# EasyEDA Pro project bandoneo.eprj

# Schematic LeftWing
Board Name: Board1; Create Date: 2025-07-18; Page Name: P1; Project Name: bandoneo; Schematic Name: LeftWing; Update Date: 2025-07-19; Company: EasyEDA.com; Page Size: A4; Version: V1.0
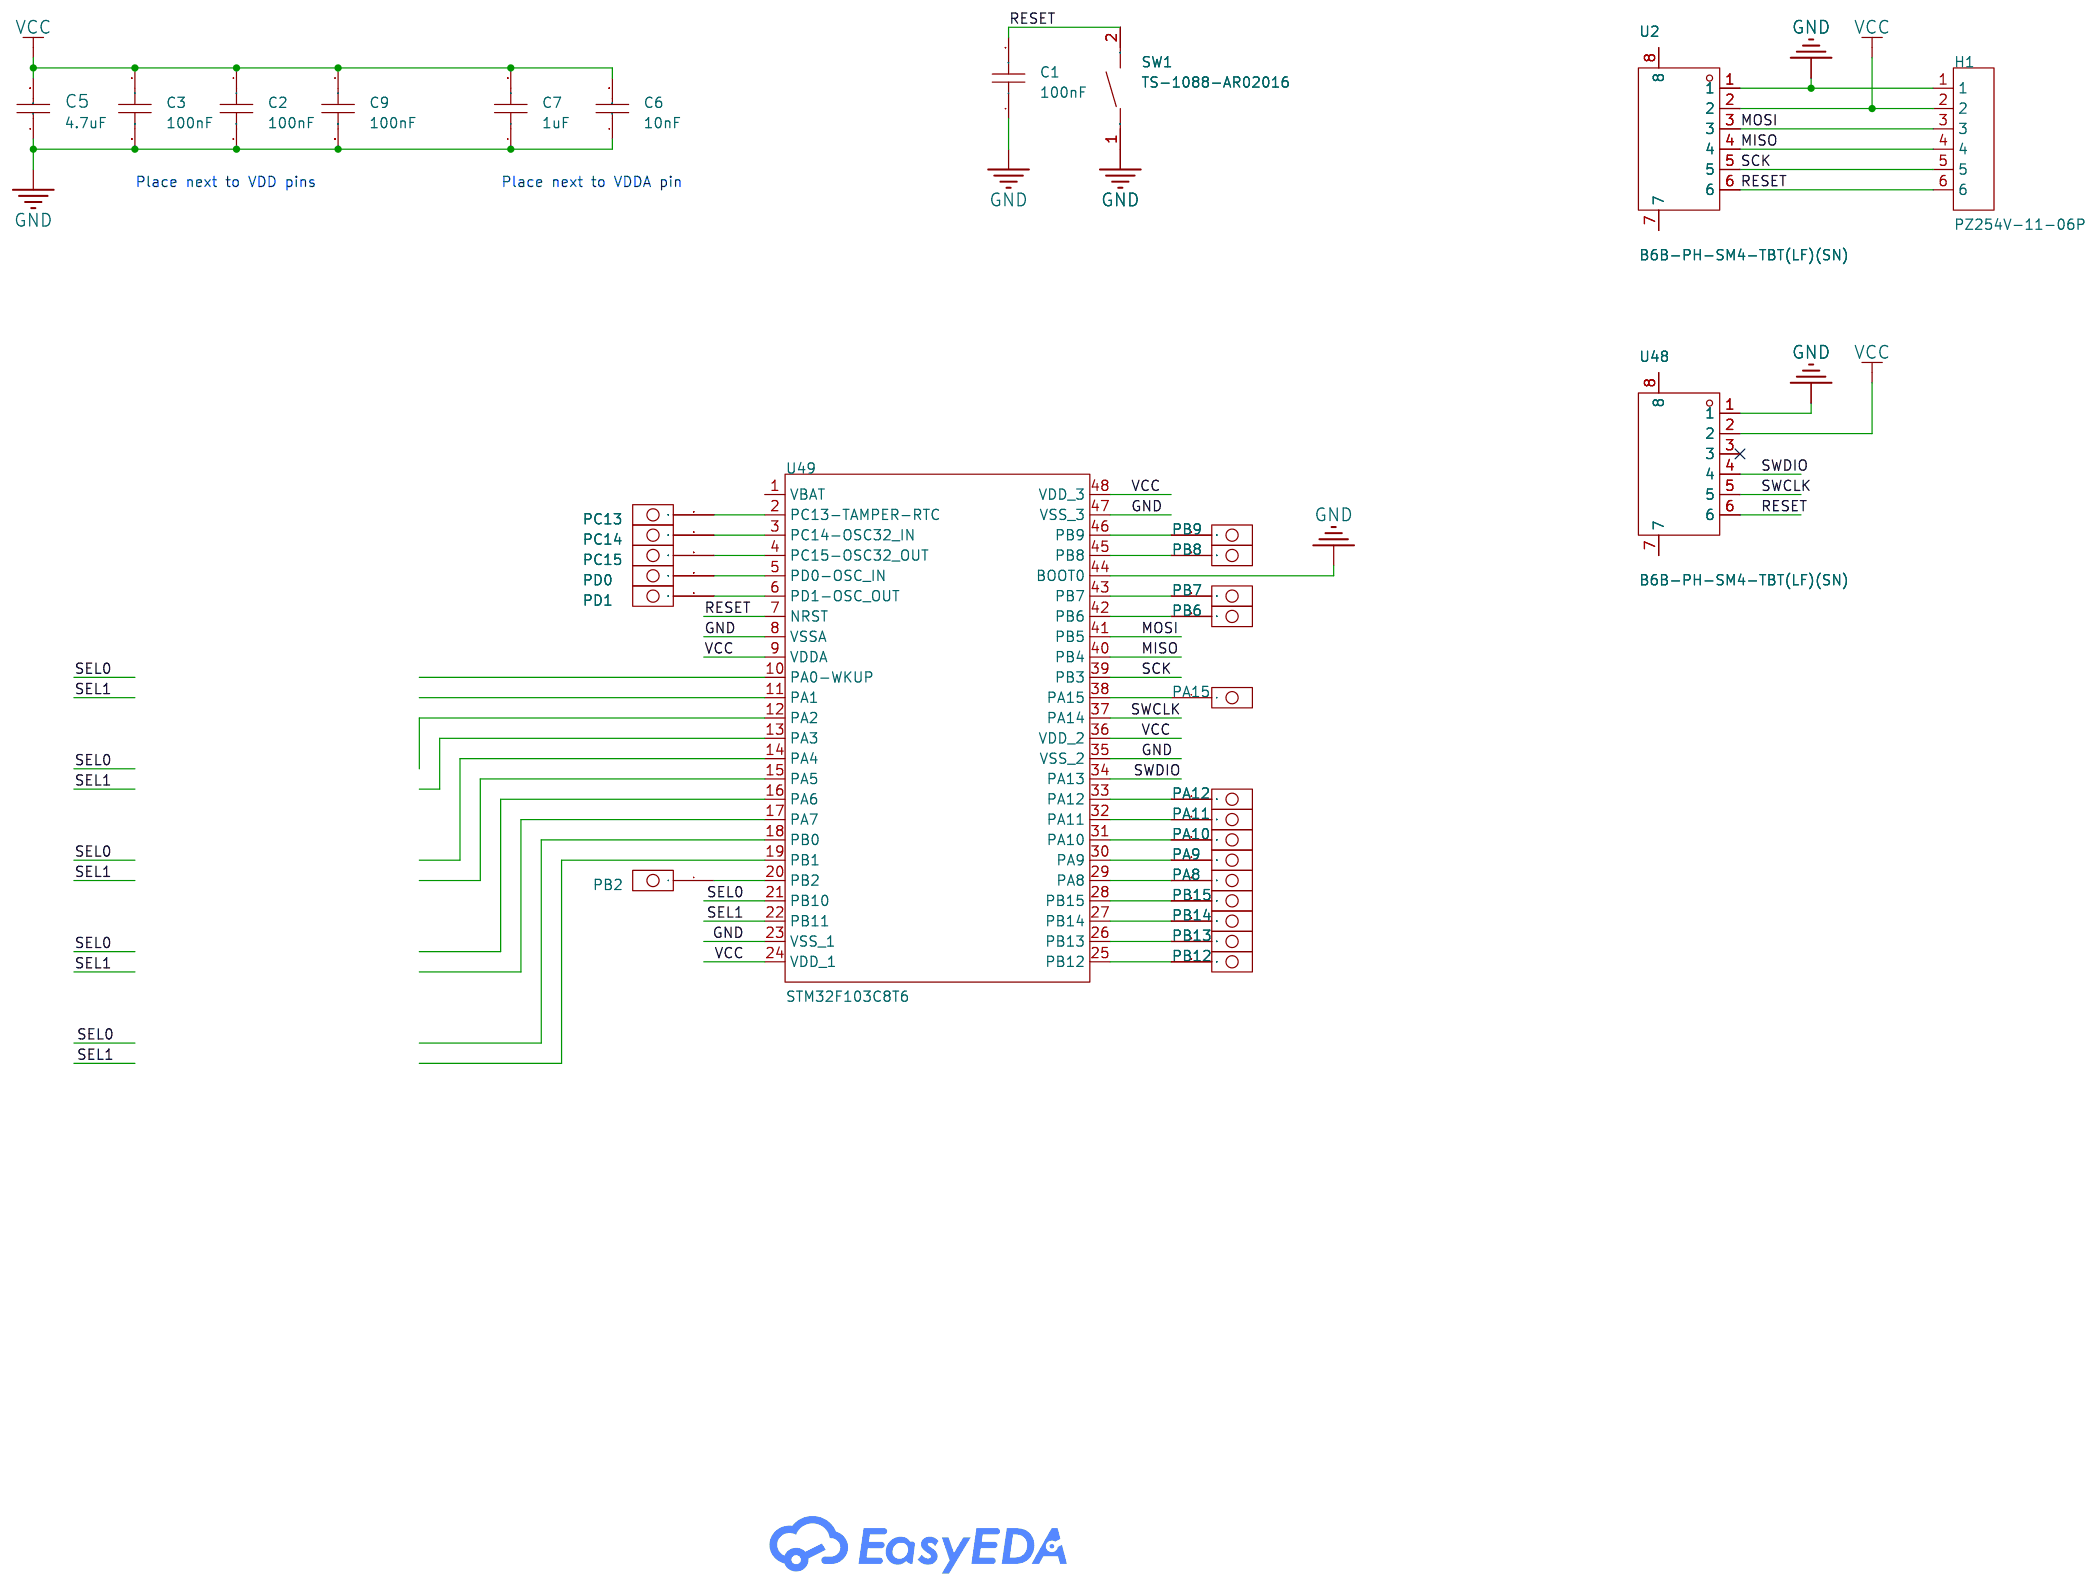
[diagram p0: schematic sheet]

## Parts
C1  100nF  [C0402]
C2  100nF  [C0402]
C3  100nF  [C0402]
C5  4.7uF  [C0402]
C6  10nF  [C0402]
C7  1uF  [C0402]
C9  100nF  [C0402]
CBB1  -
CBB2  -
CBB3  -
CBB4  -
CBB5  -
H1  PZ254V-11-06P  [HDR-TH_6P-P2.54-V-M]  (no BOM)
PA8  -  [PinHole]
PA9  -  [PinHole]
PA10  -  [PinHole]
PA11  -  [PinHole]
PA12  -  [PinHole]
PA15  -  [PinHole]
PB2  -  [PinHole]
PB6  -  [PinHole]
PB7  -  [PinHole]
PB8  -  [PinHole]
PB9  -  [PinHole]
PB12  -  [PinHole]
PB13  -  [PinHole]
PB14  -  [PinHole]
PB15  -  [PinHole]
PC13  -  [PinHole]
PC14  -  [PinHole]
PC15  -  [PinHole]
PD0  -  [PinHole]
PD1  -  [PinHole]
SW1  TS-1088-AR02016  [SW-SMD_L3.9-W3.0-P4.45]
U2  B6B-PH-SM4-TBT(LF)(SN)  [CONN-SMD_B6B-PH-SM4-TBT-LF-SN]
U48  B6B-PH-SM4-TBT(LF)(SN)  [CONN-SMD_B6B-PH-SM4-TBT-LF-SN]
U49  STM32F103C8T6  [LQFP-48_L7.0-W7.0-P0.50-LS9.0-BL]

## Library data of the parts
C1-C3 C9 = CL05B104KO5NNNC: LCSC Part Name: 100nF ±10% 16V; Supplier Part: C1525; Manufacturer: SAMSUNG(三星); Supplier Footprint: 0402; JLCPCB Part Class: Basic Part; Datasheet: https://atta.szlcsc.com/upload/public/pdf/source/20160218/1457707763339.pdf; Supplier: LCSC; Tolerance: ±10%
C5 = CL05A475MP5NRNC: LCSC Part Name: 4.7uF ±20% 10V; Supplier Part: C23733; Manufacturer: SAMSUNG(三星); Supplier Footprint: 0402; JLCPCB Part Class: Basic Part; Datasheet: https://atta.szlcsc.com/upload/public/pdf/source/20160218/1457707763339.pdf; Supplier: LCSC; Tolerance: ±20%
C6 = CL05B103KB5NNNC: LCSC Part Name: 10nF ±10% 50V; Supplier Part: C15195; Manufacturer: SAMSUNG(三星); Supplier Footprint: 0402; JLCPCB Part Class: Basic Part; Datasheet: https://atta.szlcsc.com/upload/public/pdf/source/20160218/1457707763339.pdf; Supplier: LCSC; Tolerance: ±10%
C7 = CL05A105KA5NQNC: LCSC Part Name: 1uF ±10% 25V; Supplier Part: C52923; Manufacturer: SAMSUNG(三星); Supplier Footprint: 0402; JLCPCB Part Class: Basic Part; Datasheet: https://atta.szlcsc.com/upload/public/pdf/source/20160218/1457707763339.pdf; Supplier: LCSC; Tolerance: ±10%
H1 = PZ254V-11-06P: LCSC Part Name: 1x6P 间距:2.54mm 方针 直插; Supplier Part: C492405; Manufacturer: XFCN(兴飞); Supplier Footprint: 插件,P=2.54mm; JLCPCB Part Class: Extended Part; Datasheet: https://atta.szlcsc.com/upload/public/pdf/source/20200309/C492405_597F1930F5B55CC3C7FD95458F1C3977.pdf; Supplier: LCSC; Pin Structure: 1x6P; Pitch: 2.54mm; Circluar Pins/Square Pins: Policy; Mounting Type: Straight; Number of Rows: Single Row; Number of Pins: 6P; Length of Mating Pin: 6mm; Insulation Height: 2.5mm; Length of End Connection Pin: 3mm; Contact Material: Brass; Operating Temperature: -40℃~+105℃; Color: Black
PA8-PA12 PA15 PB2 PB6-PB9 PB12-PB15 PC13-PC15 PD0 PD1 = PinHole
SW1 = TS-1088-AR02016: LCSC Part Name: 4*3*2mm 立贴 轻触开关; Supplier Part: C720477; Manufacturer: XUNPU(讯普); Supplier Footprint: SMD; JLCPCB Part Class: Basic Part; Datasheet: https://atta.szlcsc.com/upload/public/pdf/source/20200810/C720475_60D09DD6C54279ADDB2DC25100F1CC11.pdf; Supplier: LCSC; Circuit: SPST; Actuator Style: Round Button; Operating Force: 160gf; Mounting Style: Brick nogging; Switch Length: 4mm; Switch Width: 3mm; Switch Height: 2mm; Strike Gundam: 不带; Contact Current: 50mA; Voltage Rating (DC): 12V; Insulation Resistance: 100MΩ; Actuator/Cap Color: Black; Pin Style: SMDSplicing; Mechanical Life: 10万次; Operating Temperature: -30℃~+80℃
U2 U48 = B6B-PH-SM4-TBT(LF)(SN): LCSC Part Name: 1x6P 间距:2mm 立贴 系列:PH; Supplier Part: C265088; Manufacturer: JST; Supplier Footprint: SMD,P=2mm; JLCPCB Part Class: Extended Part; Datasheet: https://atta.szlcsc.com/upload/public/pdf/source/20181010/C265101_22107ACC4D8714694FDA2DD97145FA81.pdf; Supplier: LCSC; Pins Structure: 1x6P; Pitch: 2mm; Mounting Style: Brick nogging; Reference Series: PH; Number of Pins: 6P; Number of Rows: 1; Number of PINs Per Row: 6; Current Rating (Max): 2A; Contact Material: Copper Alloy; Contact Plating: Tin; Operating Temperature Range: -25℃~+85℃; Rated Voltage (Max): 100V; Plastic Material: PA; Flame Retardant Rating: UL94V-0; Supplementary Features: 辅助焊脚; Colour: 米色; Z-Height of the Board: 6.6mm; X-Length of Bottom Edge on Board (Spacing Line): 15.95mm; Y-Width of Bottom Edge on Board: 7mm
U49 = STM32F103C8T6: LCSC Part Name: 主流增强型ARM Cortex-M3 MCU，具有64 KB Flash、72 MHz CPU、电机控制、USB和CAN; Supplier Part: C8734; Manufacturer: ST(意法半导体); Supplier Footprint: LQFP-48(7x7); JLCPCB Part Class: Extended Part; Datasheet: https://atta.szlcsc.com/upload/public/pdf/source/20220812/8363ACEC51AD55ECEB84799464F7CB85.pdf; Supplier: LCSC; CPU Core: ARM-M3; CPU Maximum Speed: 72MHz; Program Storage Size: 64KB; Program Memory Type: FLASH; Number of I/O: 37; ADC (Bit): 12bit; Voltage - Supply: 2V~3.6V

## Nets
GND: C1.1 C2.2 C3.2 C5.1 C6.1 C7.1 C9.2 H1.1 SW1.1 U2.1 U48.1 U49.8(VSSA) U49.23(VSS_1) U49.35(VSS_2) U49.44(BOOT0) U49.47(VSS_3)
VCC: C2.1 C3.1 C5.2 C6.2 C7.2 C9.1 H1.2 U2.2 U48.2 U49.9(VDDA) U49.24(VDD_1) U49.36(VDD_2) U49.48(VDD_3)
MISO: H1.4 U2.4 U49.40(PB4)
MOSI: H1.3 U2.3 U49.41(PB5)
RESET: C1.2 H1.6 SW1.2 U2.6 U48.6 U49.7(NRST)
SCK: H1.5 U2.5 U49.39(PB3)
SEL0: CBB1.(SEL1) CBB2.(SEL1) CBB3.(SEL1) CBB4.(SEL1) CBB5.(SEL1) U49.10(PA0-WKUP) U49.11(PA1) U49.12(PA2) U49.13(PA3) U49.14(PA4) U49.15(PA5) U49.16(PA6) U49.17(PA7) U49.18(PB0) U49.19(PB1) U49.21(PB10) U49.22(PB11)
SWCLK: U48.5 U49.37(PA14)
SWDIO: U48.4 U49.34(PA13)
Net-(PA8-1): PA8.1 U49.29(PA8)
Net-(PA9-1): PA9.1 U49.30(PA9)
Net-(PA10-1): PA10.1 U49.31(PA10)
Net-(PA11-1): PA11.1 U49.32(PA11)
Net-(PA12-1): PA12.1 U49.33(PA12)
Net-(PA15-1): PA15.1 U49.38(PA15)
Net-(PB2-1): PB2.1 U49.20(PB2)
Net-(PB6-1): PB6.1 U49.42(PB6)
Net-(PB7-1): PB7.1 U49.43(PB7)
Net-(PB8-1): PB8.1 U49.45(PB8)
Net-(PB9-1): PB9.1 U49.46(PB9)
Net-(PB12-1): PB12.1 U49.25(PB12)
Net-(PB13-1): PB13.1 U49.26(PB13)
Net-(PB14-1): PB14.1 U49.27(PB14)
Net-(PB15-1): PB15.1 U49.28(PB15)
Net-(PC13-1): PC13.1 U49.2(PC13-TAMPER-RTC)
Net-(PC14-1): PC14.1 U49.3(PC14-OSC32_IN)
Net-(PC15-1): PC15.1 U49.4(PC15-OSC32_OUT)
Net-(PD0-1): PD0.1 U49.5(PD0-OSC_IN)
Net-(PD1-1): PD1.1 U49.6(PD1-OSC_OUT)

Not connected (* = marked no-connect by the designer): U2 7 8; U48 3* 7 8; U49 1(VBAT)

## Notes on the sheet
- Place next to VDD pins
- Place next to VDDA pin

# Schematic KeyGroup
Create Date: 2025-07-19; Page Name: P1; Project Name: bandoneo; Schematic Name: KeyGroup; Update Date: 2025-07-19; Company: EasyEDA.com; Page Size: A4; Version: V1.0
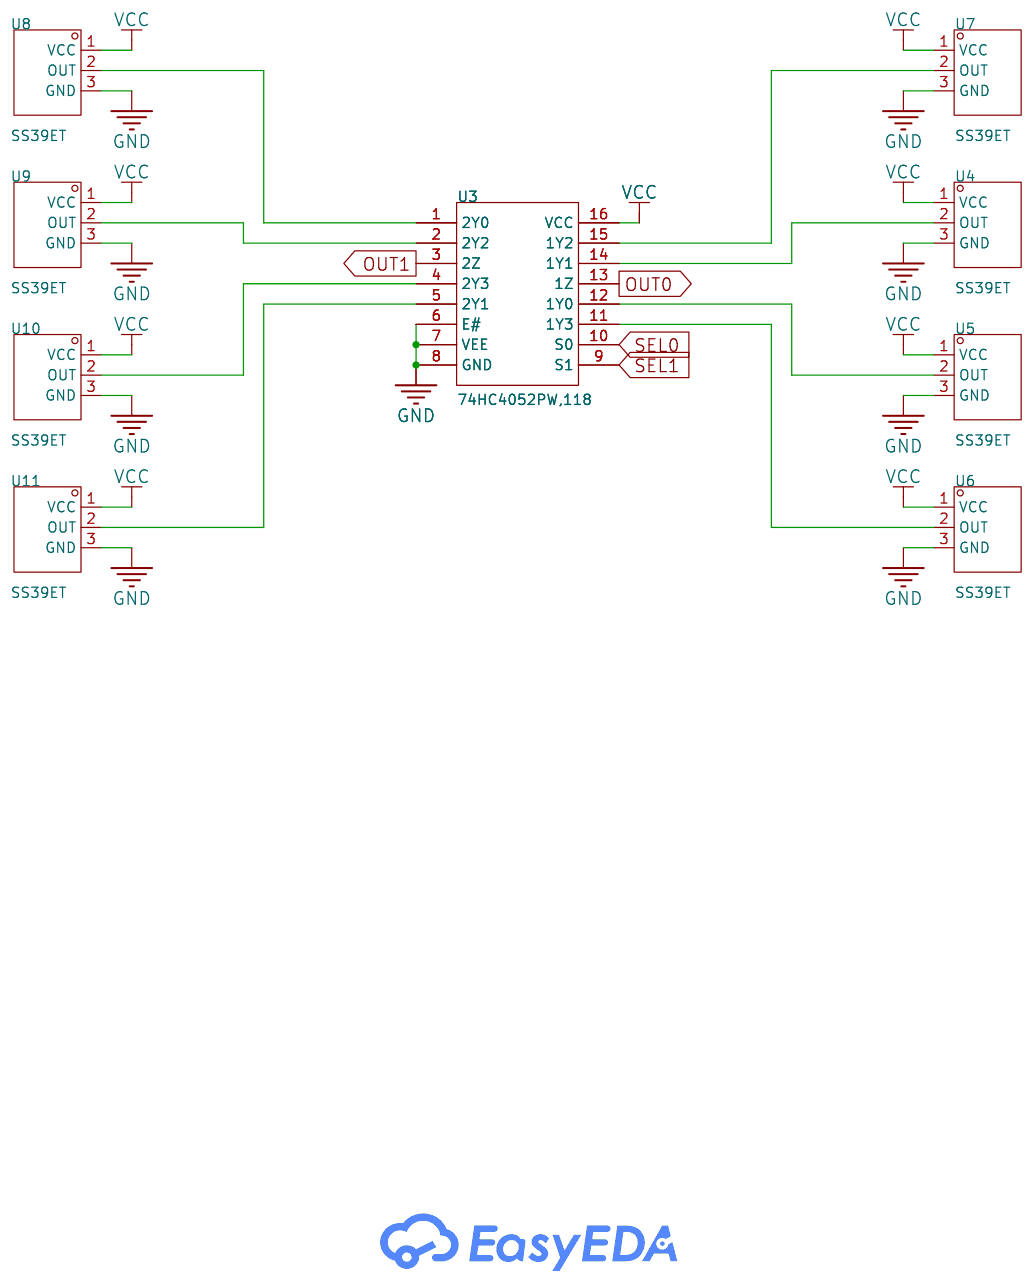
[diagram p1: schematic sheet]

## Parts
U3  74HC4052PW,118  [TSSOP-16_L5.0-W4.4-P0.65-LS6.4-BL]
U4  SS39ET  [SOT-23-3_L2.9-W1.3-P1.90-LS2.4-BR]
U5  SS39ET  [SOT-23-3_L2.9-W1.3-P1.90-LS2.4-BR]
U6  SS39ET  [SOT-23-3_L2.9-W1.3-P1.90-LS2.4-BR]
U7  SS39ET  [SOT-23-3_L2.9-W1.3-P1.90-LS2.4-BR]
U8  SS39ET  [SOT-23-3_L2.9-W1.3-P1.90-LS2.4-BR]
U9  SS39ET  [SOT-23-3_L2.9-W1.3-P1.90-LS2.4-BR]
U10  SS39ET  [SOT-23-3_L2.9-W1.3-P1.90-LS2.4-BR]
U11  SS39ET  [SOT-23-3_L2.9-W1.3-P1.90-LS2.4-BR]

## Library data of the parts
U3 = 74HC4052PW,118: LCSC Part Name: 双4通道模拟多路复用器/解复用器; Supplier Part: C5646; Manufacturer: Nexperia(安世); Supplier Footprint: TSSOP-16; JLCPCB Part Class: Extended Part; Datasheet: https://atta.szlcsc.com/upload/public/pdf/source/20240724/4C5FEE3CF984089BDDF29F9B8CF19B75.pdf; Supplier: LCSC; Switch Circuit: Single Pole Four Throw (SP4T); Number of Channels: 2; Supply Voltage: 2V~10V; Turn-on time: 58ns; On-State Resistance (Max): 150Ω; Turn-off time: 48ns
U4-U11 = SS39ET: LCSC Part Name: 霍尔效应传感器; Supplier Part: C126669; Manufacturer: Honeywell(霍尼韦尔); Supplier Footprint: SOT-23; JLCPCB Part Class: Extended Part; Datasheet: https://atta.szlcsc.com/upload/public/pdf/source/20170818/C126669_1503051285385895342.pdf; Supplier: LCSC; supply voltage: 2.7V~6.5V; Operating Temperature: -40℃~+85℃

## Nets
GND: U3.6(E#) U3.7(VEE) U3.8(GND) U4.3(GND) U5.3(GND) U6.3(GND) U7.3(GND) U8.3(GND) U9.3(GND) U10.3(GND) U11.3(GND)
VCC: U3.16(VCC) U4.1(VCC) U5.1(VCC) U6.1(VCC) U7.1(VCC) U8.1(VCC) U9.1(VCC) U10.1(VCC) U11.1(VCC)
OUT0: U3.13(1Z)
OUT1: U3.3(2Z)
SEL0: U3.10(S0)
SEL1: U3.9(S1)
Net-(U3-1): U3.1(2Y0) U8.2(OUT)
Net-(U3-2): U3.2(2Y2) U9.2(OUT)
Net-(U3-4): U3.4(2Y3) U10.2(OUT)
Net-(U3-5): U3.5(2Y1) U11.2(OUT)
Net-(U3-11): U3.11(1Y3) U6.2(OUT)
Net-(U3-12): U3.12(1Y0) U5.2(OUT)
Net-(U3-14): U3.14(1Y1) U4.2(OUT)
Net-(U3-15): U3.15(1Y2) U7.2(OUT)

# Board PCB1
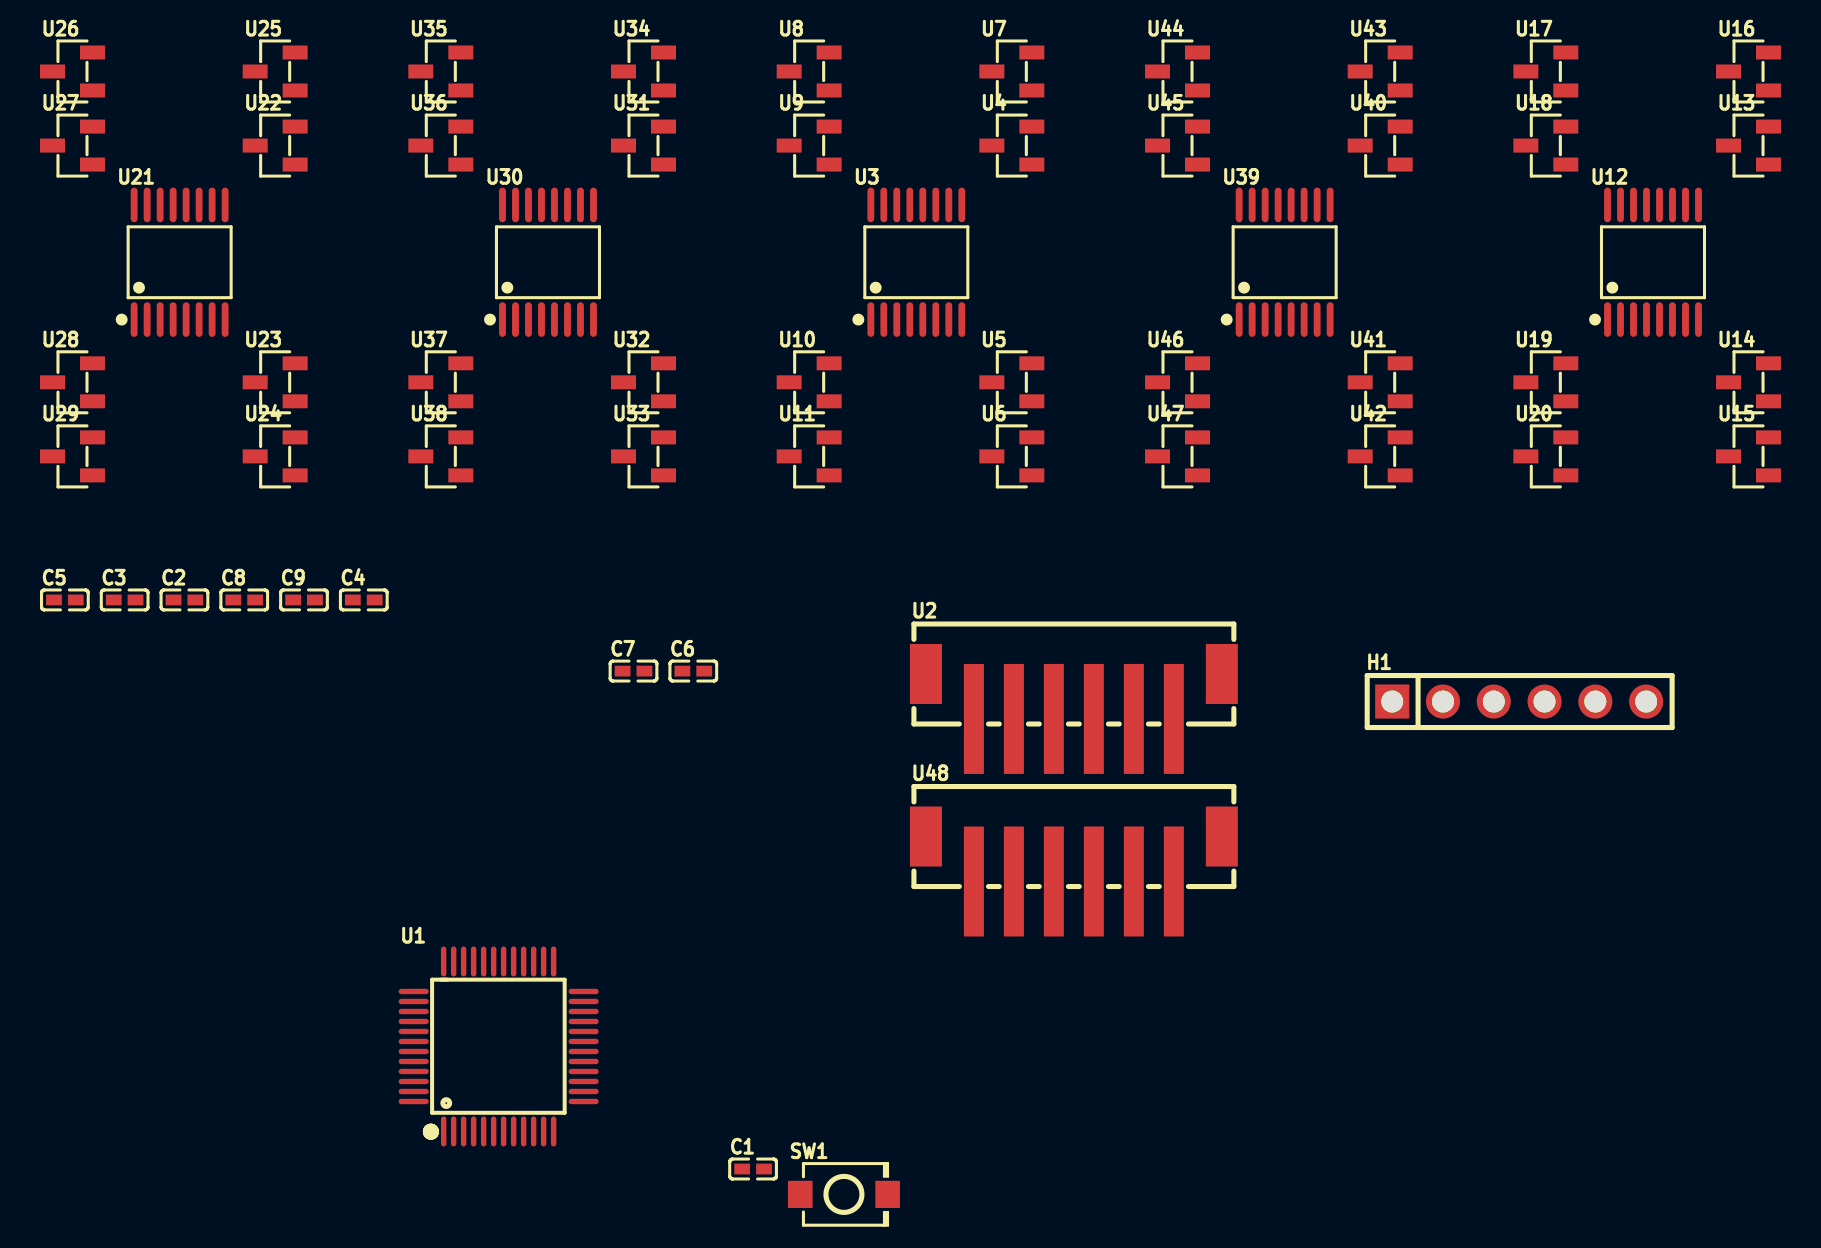
[diagram p2: board, top side]
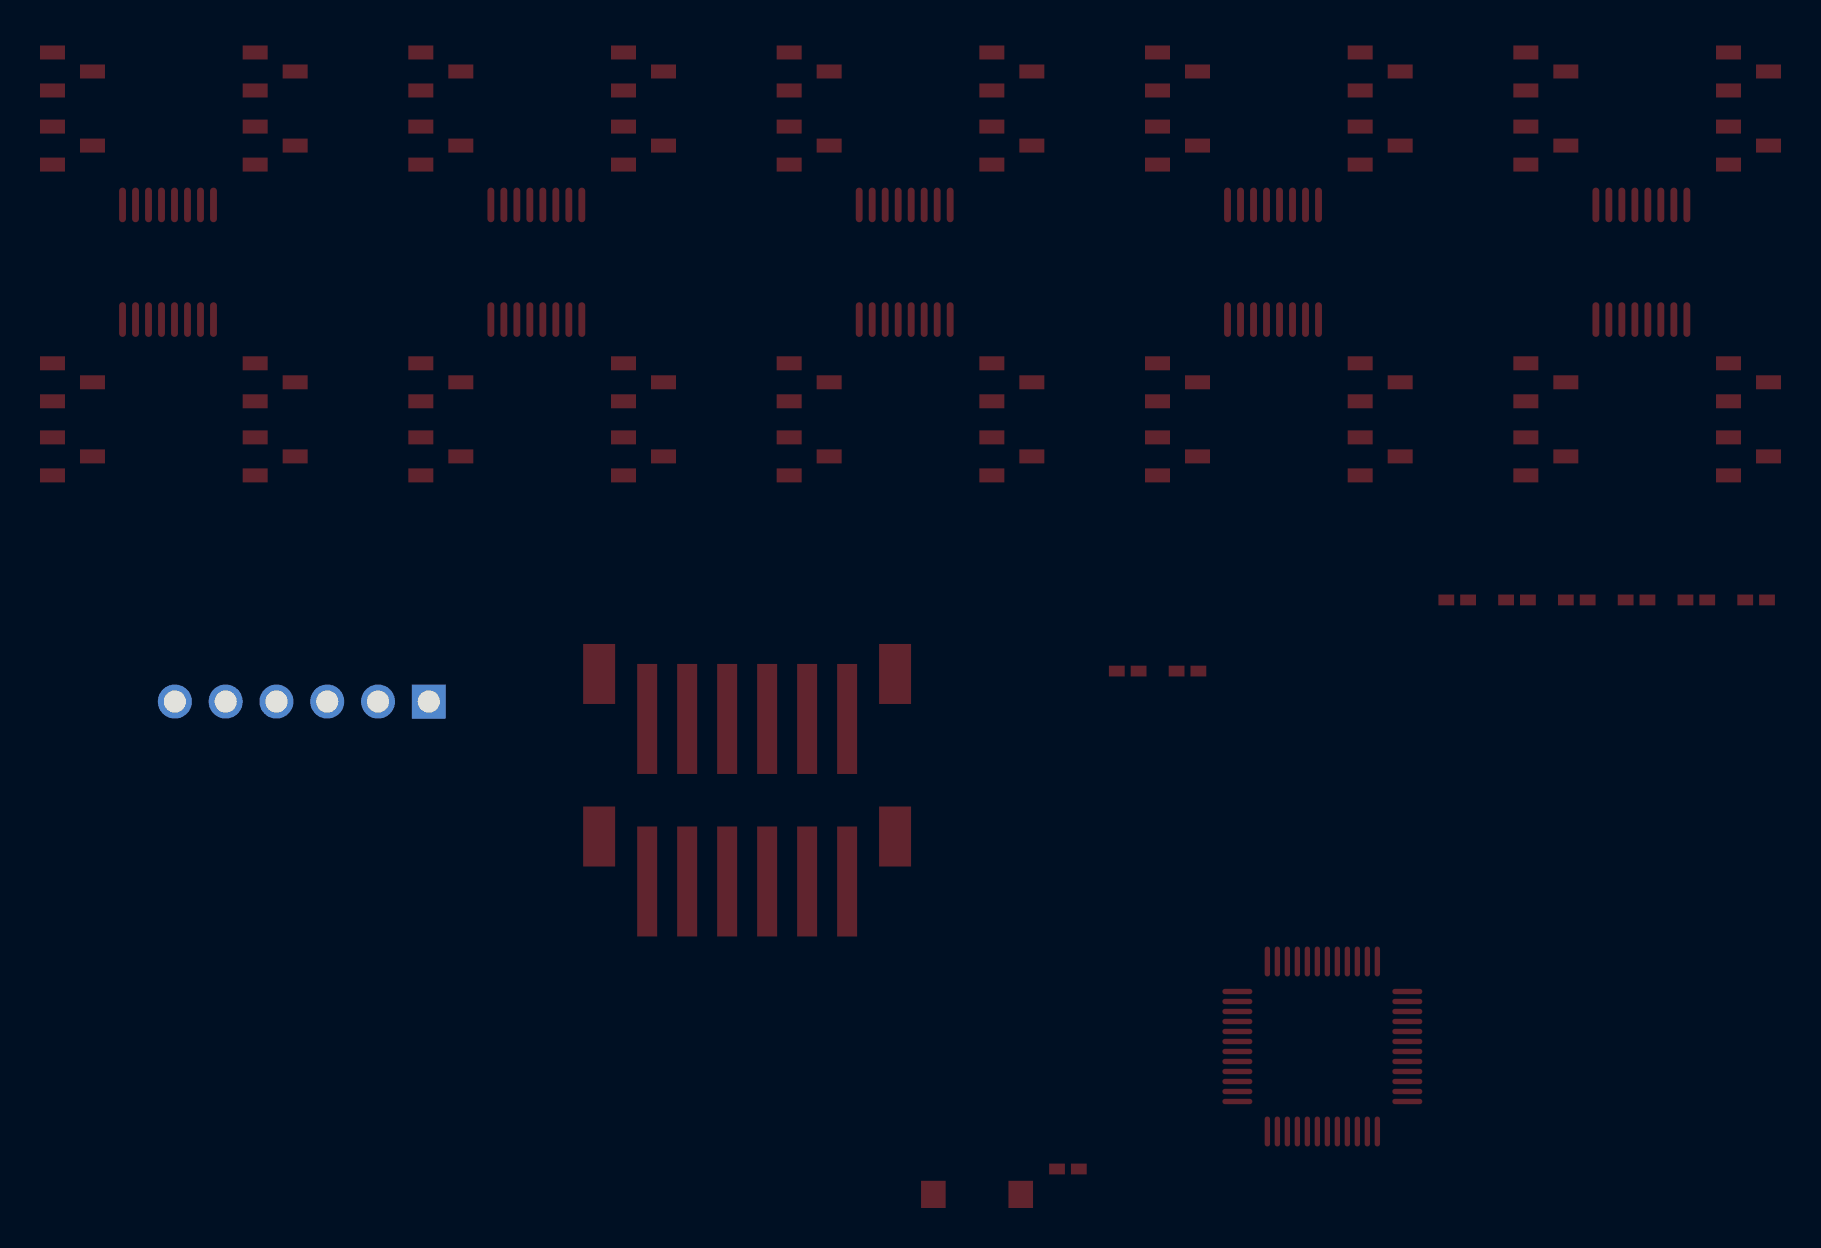
[diagram p3: board, bottom side, seen from below]

No outline. copper layers: Top Layer, Bottom Layer. Coordinates in mm from the lowest, leftmost part position.
Stack: Top Layer 0.035mm / Dielectric1 1.51mm FR4 er 4.5 / Bottom Layer 0.035mm

## Design rules (mm)
template: JLCPCB Capability(Two Layers Board)
spacing copperThickness1oz (default): track to track 0.102, other pairs 0.152 to 0.3
spacing copperThickness2oz: track to track 0.203, other pairs 0.152 to 0.3
track width copperThickness1oz (default): min 0.127, default 0.254, max 2.54
track width copperThickness2oz: min 0.203, default 0.254, max 2.54
differential pair differentialPair (default): width min 0.127, default 0.254, max 2.54; gap min 0.152, default 0.152
via viaSize (default): diameter min 0.5, default 0.61, max 10; hole min 0.3, default 0.305, max 6.3

## Placement (name value [footprint] x y rotation side)
C1  100nF  [C0402]  34.42 1.27 0 top
C2  100nF  [C0402]  5.98 29.72 0 top
C3  100nF  [C0402]  2.99 29.72 0 top
C4  100nF  [C0402]  14.95 29.72 0 top
C5  4.7uF  [C0402]  0 29.72 0 top
C6  10nF  [C0402]  31.43 26.17 0 top
C7  1uF  [C0402]  28.44 26.17 0 top
C8  4.7uF  [C0402]  8.97 29.72 0 top
C9  100nF  [C0402]  11.96 29.72 0 top
H1  PZ254V-11-06P  [HDR-TH_6P-P2.54-V-M]  72.73 24.64 0 top
SW1  TS-1088-AR02016  [SW-SMD_L3.9-W3.0-P4.45]  38.96 0 0 top
U1  STM32F030C8T6  [LQFP-48_L7.0-W7.0-P0.50-LS9.0-BL]  21.69 7.39 0 top
U2  B6B-PH-SM4-TBT(LF)(SN)  [CONN-SMD_B6B-PH-SM4-TBT-LF-SN]  50.46 24.9 0 top
U3  74HC4052PW,118  [TSSOP-16_L5.0-W4.4-P0.65-LS6.4-BL]  42.58 46.61 0 top
U4  SS39ET  [SOT-23-3_L2.9-W1.3-P1.90-LS2.4-BR]  47.36 52.44 0 top
U5  SS39ET  [SOT-23-3_L2.9-W1.3-P1.90-LS2.4-BR]  47.36 40.61 0 top
U6  SS39ET  [SOT-23-3_L2.9-W1.3-P1.90-LS2.4-BR]  47.36 36.9 0 top
U7  SS39ET  [SOT-23-3_L2.9-W1.3-P1.90-LS2.4-BR]  47.36 56.15 0 top
U8  SS39ET  [SOT-23-3_L2.9-W1.3-P1.90-LS2.4-BR]  37.22 56.15 0 top
U9  SS39ET  [SOT-23-3_L2.9-W1.3-P1.90-LS2.4-BR]  37.22 52.44 0 top
U10  SS39ET  [SOT-23-3_L2.9-W1.3-P1.90-LS2.4-BR]  37.22 40.61 0 top
U11  SS39ET  [SOT-23-3_L2.9-W1.3-P1.90-LS2.4-BR]  37.22 36.9 0 top
U12  74HC4052PW,118  [TSSOP-16_L5.0-W4.4-P0.65-LS6.4-BL]  79.42 46.61 0 top
U13  SS39ET  [SOT-23-3_L2.9-W1.3-P1.90-LS2.4-BR]  84.2 52.44 0 top
U14  SS39ET  [SOT-23-3_L2.9-W1.3-P1.90-LS2.4-BR]  84.2 40.61 0 top
U15  SS39ET  [SOT-23-3_L2.9-W1.3-P1.90-LS2.4-BR]  84.2 36.9 0 top
U16  SS39ET  [SOT-23-3_L2.9-W1.3-P1.90-LS2.4-BR]  84.2 56.15 0 top
U17  SS39ET  [SOT-23-3_L2.9-W1.3-P1.90-LS2.4-BR]  74.07 56.15 0 top
U18  SS39ET  [SOT-23-3_L2.9-W1.3-P1.90-LS2.4-BR]  74.07 52.44 0 top
U19  SS39ET  [SOT-23-3_L2.9-W1.3-P1.90-LS2.4-BR]  74.07 40.61 0 top
U20  SS39ET  [SOT-23-3_L2.9-W1.3-P1.90-LS2.4-BR]  74.07 36.9 0 top
U21  74HC4052PW,118  [TSSOP-16_L5.0-W4.4-P0.65-LS6.4-BL]  5.74 46.61 0 top
U22  SS39ET  [SOT-23-3_L2.9-W1.3-P1.90-LS2.4-BR]  10.52 52.44 0 top
U23  SS39ET  [SOT-23-3_L2.9-W1.3-P1.90-LS2.4-BR]  10.52 40.61 0 top
U24  SS39ET  [SOT-23-3_L2.9-W1.3-P1.90-LS2.4-BR]  10.52 36.9 0 top
U25  SS39ET  [SOT-23-3_L2.9-W1.3-P1.90-LS2.4-BR]  10.52 56.15 0 top
U26  SS39ET  [SOT-23-3_L2.9-W1.3-P1.90-LS2.4-BR]  0.38 56.15 0 top
U27  SS39ET  [SOT-23-3_L2.9-W1.3-P1.90-LS2.4-BR]  0.38 52.44 0 top
U28  SS39ET  [SOT-23-3_L2.9-W1.3-P1.90-LS2.4-BR]  0.38 40.61 0 top
U29  SS39ET  [SOT-23-3_L2.9-W1.3-P1.90-LS2.4-BR]  0.38 36.9 0 top
U30  74HC4052PW,118  [TSSOP-16_L5.0-W4.4-P0.65-LS6.4-BL]  24.16 46.61 0 top
U31  SS39ET  [SOT-23-3_L2.9-W1.3-P1.90-LS2.4-BR]  28.94 52.44 0 top
U32  SS39ET  [SOT-23-3_L2.9-W1.3-P1.90-LS2.4-BR]  28.94 40.61 0 top
U33  SS39ET  [SOT-23-3_L2.9-W1.3-P1.90-LS2.4-BR]  28.94 36.9 0 top
U34  SS39ET  [SOT-23-3_L2.9-W1.3-P1.90-LS2.4-BR]  28.94 56.15 0 top
U35  SS39ET  [SOT-23-3_L2.9-W1.3-P1.90-LS2.4-BR]  18.8 56.15 0 top
U36  SS39ET  [SOT-23-3_L2.9-W1.3-P1.90-LS2.4-BR]  18.8 52.44 0 top
U37  SS39ET  [SOT-23-3_L2.9-W1.3-P1.90-LS2.4-BR]  18.8 40.61 0 top
U38  SS39ET  [SOT-23-3_L2.9-W1.3-P1.90-LS2.4-BR]  18.8 36.9 0 top
U39  74HC4052PW,118  [TSSOP-16_L5.0-W4.4-P0.65-LS6.4-BL]  61 46.61 0 top
U40  SS39ET  [SOT-23-3_L2.9-W1.3-P1.90-LS2.4-BR]  65.78 52.44 0 top
U41  SS39ET  [SOT-23-3_L2.9-W1.3-P1.90-LS2.4-BR]  65.78 40.61 0 top
U42  SS39ET  [SOT-23-3_L2.9-W1.3-P1.90-LS2.4-BR]  65.78 36.9 0 top
U43  SS39ET  [SOT-23-3_L2.9-W1.3-P1.90-LS2.4-BR]  65.78 56.15 0 top
U44  SS39ET  [SOT-23-3_L2.9-W1.3-P1.90-LS2.4-BR]  55.64 56.15 0 top
U45  SS39ET  [SOT-23-3_L2.9-W1.3-P1.90-LS2.4-BR]  55.64 52.44 0 top
U46  SS39ET  [SOT-23-3_L2.9-W1.3-P1.90-LS2.4-BR]  55.64 40.61 0 top
U47  SS39ET  [SOT-23-3_L2.9-W1.3-P1.90-LS2.4-BR]  55.64 36.9 0 top
U48  B6B-PH-SM4-TBT(LF)(SN)  [CONN-SMD_B6B-PH-SM4-TBT-LF-SN]  50.46 16.77 0 top

## Footprints (pads in the part's own frame, mm; a bottom-side part is the same pattern mirrored in y, then rotated)
C0402
  rect 0.79x0.54 smd: 1(-0.545,0) 2(0.545,0)
CONN-SMD_B6B-PH-SM4-TBT-LF-SN
  rect 1x5.5 smd: 1(-5.002,-1.125) 2(-3.002,-1.123) 3(-1.002,-1.123) 4(0.998,-1.123) 5(2.998,-1.123) 6(4.998,-1.123)
  rect 1.6x3 smd: 7(7.4,1.125) 8(-7.4,1.125)
HDR-TH_6P-P2.54-V-M
  rect 1.7x1.7 hole 1.1: 1(-6.35,0)
  round 1.7 hole 1.1: 2(-3.81,0) 3(-1.27,0) 4(1.27,0) 5(3.81,0) 6(6.35,0)
LQFP-48_L7.0-W7.0-P0.50-LS9.0-BL
  oval 0.27x1.5 smd: 1(-2.75,-4.25) 2(-2.25,-4.25) 3(-1.75,-4.25) 4(-1.25,-4.25) 5(-0.75,-4.25) 6(-0.25,-4.25) 7(0.25,-4.25) 8(0.75,-4.25) 9(1.25,-4.25) 10(1.75,-4.25) 11(2.25,-4.25) 12(2.75,-4.25) 25(2.75,4.25) 26(2.25,4.25) 27(1.75,4.25) 28(1.25,4.25) 29(0.75,4.25) 30(0.25,4.25) 31(-0.25,4.25) 32(-0.75,4.25) 33(-1.25,4.25) 34(-1.75,4.25) 35(-2.25,4.25) 36(-2.75,4.25)
  oval 1.5x0.27 smd: 13(4.25,-2.75) 14(4.25,-2.25) 15(4.25,-1.75) 16(4.25,-1.25) 17(4.25,-0.75) 18(4.25,-0.25) 19(4.25,0.25) 20(4.25,0.75) 21(4.25,1.25) 22(4.25,1.75) 23(4.25,2.25) 24(4.25,2.75) 37(-4.25,2.75) 38(-4.25,2.25) 39(-4.25,1.75) 40(-4.25,1.25) 41(-4.25,0.75) 42(-4.25,0.25) 43(-4.25,-0.25) 44(-4.25,-0.75) 45(-4.25,-1.25) 46(-4.25,-1.75) 47(-4.25,-2.25) 48(-4.25,-2.75)
SOT-23-3_L2.9-W1.3-P1.90-LS2.4-BR
  rect 1.25x0.7 smd: 1(1,-0.95) 2(1,0.95) 3(-1,0)
SW-SMD_L3.9-W3.0-P4.45
  rect 1.23x1.36 smd: 1(-2.185,0) 2(2.185,0)
TSSOP-16_L5.0-W4.4-P0.65-LS6.4-BL
  oval 0.343x1.732 smd: 1(-2.275,-2.866) 2(-1.625,-2.866) 3(-0.975,-2.866) 4(-0.325,-2.866) 5(0.325,-2.866) 6(0.975,-2.866) 7(1.625,-2.866) 8(2.275,-2.866) 9(2.275,2.866) 10(1.625,2.866) 11(0.975,2.866) 12(0.325,2.866) 13(-0.325,2.866) 14(-0.975,2.866) 15(-1.625,2.866) 16(-2.275,2.866)

## Nets
GND: C1.1 C2.2 C3.2 C4.2 C5.1 C6.1 C7.1 C8.1 C9.2 H1.1 SW1.1 U1.8 U1.23 U1.44 U1.47 U2.1 U3.6 U3.7 U3.8 U4.3 U5.3 U6.3 U7.3 U8.3 U9.3 U10.3 U11.3 U12.6 U12.7 U12.8 U13.3 U14.3 U15.3 U16.3 U17.3 U18.3 U19.3 U20.3 U21.6 U21.7 U21.8 U22.3 U23.3 U24.3 U25.3 U26.3 U27.3 U28.3 U29.3 U30.6 U30.7 U30.8 U31.3 U32.3 U33.3 U34.3 U35.3 U36.3 U37.3 U38.3 U39.6 U39.7 U39.8 U40.3 U41.3 U42.3 U43.3 U44.3 U45.3 U46.3 U47.3 U48.1
VCC: C2.1 C3.1 C4.1 C5.2 C8.2 C9.1 H1.2 U1.1 U1.24 U1.48 U2.2 U3.16 U4.1 U5.1 U6.1 U7.1 U8.1 U9.1 U10.1 U11.1 U12.16 U13.1 U14.1 U15.1 U16.1 U17.1 U18.1 U19.1 U20.1 U21.16 U22.1 U23.1 U24.1 U25.1 U26.1 U27.1 U28.1 U29.1 U30.16 U31.1 U32.1 U33.1 U34.1 U35.1 U36.1 U37.1 U38.1 U39.16 U40.1 U41.1 U42.1 U43.1 U44.1 U45.1 U46.1 U47.1 U48.2
$1I7118\$1N697: U3.1 U8.2
$1I7118\$1N698: U3.2 U9.2
$1I7118\$1N699: U3.4 U10.2
$1I7118\$1N703: U3.5 U11.2
$1I7118\$1N707: U3.15 U7.2
$1I7118\$1N708: U3.14 U4.2
$1I7118\$1N710: U3.12 U5.2
$1I7118\$1N711: U3.11 U6.2
$1I7144\$1N697: U12.1 U17.2
$1I7144\$1N698: U12.2 U18.2
$1I7144\$1N699: U12.4 U19.2
$1I7144\$1N703: U12.5 U20.2
$1I7144\$1N707: U12.15 U16.2
$1I7144\$1N708: U12.14 U13.2
$1I7144\$1N710: U12.12 U14.2
$1I7144\$1N711: U12.11 U15.2
$1I8116\$1N697: U21.1 U26.2
$1I8116\$1N698: U21.2 U27.2
$1I8116\$1N699: U21.4 U28.2
$1I8116\$1N703: U21.5 U29.2
$1I8116\$1N707: U21.15 U25.2
$1I8116\$1N708: U21.14 U22.2
$1I8116\$1N710: U21.12 U23.2
$1I8116\$1N711: U21.11 U24.2
$1I8142\$1N697: U30.1 U35.2
$1I8142\$1N698: U30.2 U36.2
$1I8142\$1N699: U30.4 U37.2
$1I8142\$1N703: U30.5 U38.2
$1I8142\$1N707: U30.15 U34.2
$1I8142\$1N708: U30.14 U31.2
$1I8142\$1N710: U30.12 U32.2
$1I8142\$1N711: U30.11 U33.2
$1I8246\$1N697: U39.1 U44.2
$1I8246\$1N698: U39.2 U45.2
$1I8246\$1N699: U39.4 U46.2
$1I8246\$1N703: U39.5 U47.2
$1I8246\$1N707: U39.15 U43.2
$1I8246\$1N708: U39.14 U40.2
$1I8246\$1N710: U39.12 U41.2
$1I8246\$1N711: U39.11 U42.2
MISO: H1.4 U1.40 U2.4
MOSI: H1.3 U1.41 U2.3
NET9: U1.43
RESET: C1.2 H1.6 SW1.2 U1.7 U2.6 U48.6
SCK: H1.5 U1.39 U2.5
SEL0: U1.21 U3.10 U12.10 U21.10 U30.10 U39.10
SEL1: U1.22 U3.9 U12.9 U21.9 U30.9 U39.9
SWCLK: U1.37 U48.5
SWDIO: U1.34 U48.4
$1N1190: C6.2 C7.2 U1.9
$1N7072: U1.10 U21.13
$1N7076: U1.11 U21.3
$1N7081: U1.12 U30.13
$1N7087: U1.13 U30.3
$1N7198: U1.14 U3.13
$1N7204: U1.15 U3.3
$1N7658: U1.16 U12.13
$1N7667: U1.17 U12.3
$1N8326: U1.18 U39.13
$1N8330: U1.19 U39.3

Pads without a net: U1 2 3 4 5 6 20 25 26 27 28 29 30 31 32 33 35 36 38 42 45 46; U2 7 8; U48 3 7 8
